# EAGLE design MiniDice (EAGLE 9.2.0)
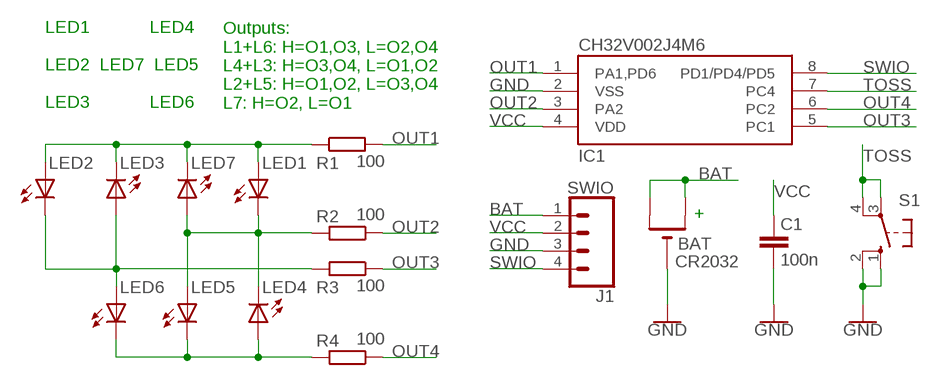
[diagram p0: schematic, sheet 1]

## Parts
BAT  CR2032  CR2032SMT  [CR2032-SMD]
C1  100n  C-EUC1206K  [C1206K]
IC1  CH32V002J4M6  CH32V003J4M6  [SOP8]
J1  SWIO  CONN_04SMD_LONG  [1X04_SMD_LONG]
LED1  LEDLED5MMB  [LED5MMB]
LED2  LEDLED5MMB  [LED5MMB]
LED3  LEDLED5MMB  [LED5MMB]
LED4  LEDLED5MMB  [LED5MMB]
LED5  LEDLED5MMB  [LED5MMB]
LED6  LEDLED5MMB  [LED5MMB]
LED7  LEDLED5MMB  [LED5MMB]
R1  100  R-EU_M1206  [M1206]
R2  100  R-EU_M1206  [M1206]
R3  100  R-EU_M1206  [M1206]
R4  100  R-EU_M1206  [M1206]
S1  10-XXB3F-10XXSMD  [B3F-10XXSMD]

## Nets
BAT: BAT.+$1(+) BAT.+$2(+1) J1.1
GND: BAT.- C1.2 IC1.2(VSS) J1.3 S1.1(S) S1.2(S1)
N$1: LED4.A LED5.K(C) LED6.K(C) R4.2
N$2: LED1.A LED2.A LED3.K(C) LED7.K(C) R1.1
N$3: LED1.K(C) LED4.K(C) LED5.A LED7.A R2.2
N$4: LED2.K(C) LED3.A LED6.A R3.2
OUT1: IC1.1(PA1,PD6) R1.2
OUT2: IC1.3(PA2) R2.1
OUT3: IC1.5(PC1) R3.1
OUT4: IC1.6(PC2) R4.1
SWIO: IC1.8(PD1/PD4/PD5) J1.4
TOSS: IC1.7(PC4) S1.3(P) S1.4(P1)
VCC: C1.1 IC1.4(VDD) J1.2

## Notes on the sheet
- Outputs:
  L1+L6: H=O1,O3, L=O2,O4
  L4+L3: H=O3,O4, L=O1,O2
  L2+L5: H=O1,O2, L=O3,O4
  L7: H=O2, L=O1
- LED1            LED4
  
  LED2  LED7  LED5
  
  LED3            LED6
- +

## Library data of the parts
BAT = adafruit:CR2032
C1 = rcl:C-EU: CAPACITOR, European symbol; SPICEPREFIX: C
IC1 = CH32V:CH32V003J4M6
J1 = SparkFun-Connectors:CONN_04: Multi connection point. Often used as Generic Header-pin footprint for 0.1 inch spaced/style header connections On any of the 0.1 inch spaced packages, you can populate with these: Break Away Headers - Straight <https://www.sparkfun.com/products/116> (PRT-00116) Break Away Male Headers - Right Angle <https://www.sparkfun.com/products/553> (PRT-00553) Female Headers <https://www.sparkfun.com/products/115> (PRT-00115) Break Away Headers - Machine Pin <https://www.sparkfun.com/products/117> (PRT-00117) Break Away Female Headers - Swiss Machine Pin <https://www.sparkfun.com/products/743> (PRT-00743) For SCREWTERMINALS and SPRING TERMINALS visit here: Screw Terimnals on SparkFun.com <https://www.sparkfun.com/search/results?term=Screw+Terminals> (5mm/3.5mm/2.54mm spacing) This device is also useful as a general connection point to wire up your design to another part of your project. Our various solder wires solder well into these plated through hole pads. Hook-Up Wire - Assortment (Stranded, 22 AWG) <https://www.sparkfun.com/products/11375> (PRT-11375) Hook-Up Wire - Assortment (Solid Core, 22 AWG) <https://www.sparkfun.com/products/11367> (PRT-11367) View the entire wire category on our website here <https://www.sparkfun.com/categories/141> Special notes: Molex polarized connector foot print use with SKU : PRT-08231 with associated crimp pins and housings. 1MM SMD Version SKU: PRT-10208; PROD_ID: CONN-09140; SF_ID: PRT-12638
LED1-LED7 = adafruit_B:LED: LED OSRAM: - CHIPLED LG R971, LG N971, LY N971, LG Q971, LY Q971, LO R971, LY R971 LH N974, LH R974 LS Q976, LO Q976, LY Q976 LO Q996 - Hyper CHIPLED LW Q18S LB Q993, LB Q99A, LB R99A - SideLED LS A670, LO A670, LY A670, LG A670, LP A670 LB A673, LV A673, LT A673, LW A673 LH A674 LY A675 LS A676, LA A676, LO A676, LY A676, LW A676 LS A679, LY A679, LG A679 - Hyper Micro SIDELED® LS Y876, LA Y876, LO Y876, LY Y876 LT Y87S - SmartLED LW L88C, LW L88S LB L89C, LB L89S, LG L890 LS L89K, LO L89K, LY L89K LS L896, LA L896, LO L896, LY L896 - TOPLED LS T670, LO T670, LY T670, LG T670, LP T670 LSG T670, LSP T670, LSY T670, LOP T670, LYG T670 LG T671, LOG T671, LSG T671 LB T673, LV T673, LT T673, LW T673 LH T674 LS T676, LA T676, LO T676, LY T676, LB T676, LH T676, LSB T676, LW T676 LB T67C, LV T67C, LT T67C, LS T67K, LO T67K, LY T67K, LW E67C LS E67B, LA E67B, LO E67B, LY E67B, LB E67C, LV E67C, LT E67C LW T67C LS T679, LY T679, LG T679 LS T770, LO T770, LY T770, LG T770, LP T770 LB T773, LV T773, LT T773, LW T773 LH T774 LS E675, LA E675, LY E675, LS T675 LS T776, LA T776, LO T776, LY T776, LB T776 LHGB T686 LT T68C, LB T68C - Hyper Mini TOPLED® LB M676 - Mini TOPLED Santana® LG M470 LS M47K, LO M47K, LY M47K Source: http://www.osram.convergy.de/
R1-R4 = rcl:R-EU_: RESISTOR, European symbol; SPICEPREFIX: R
S1 = switch-omron2:10-XX: OMRON SWITCH

## Board
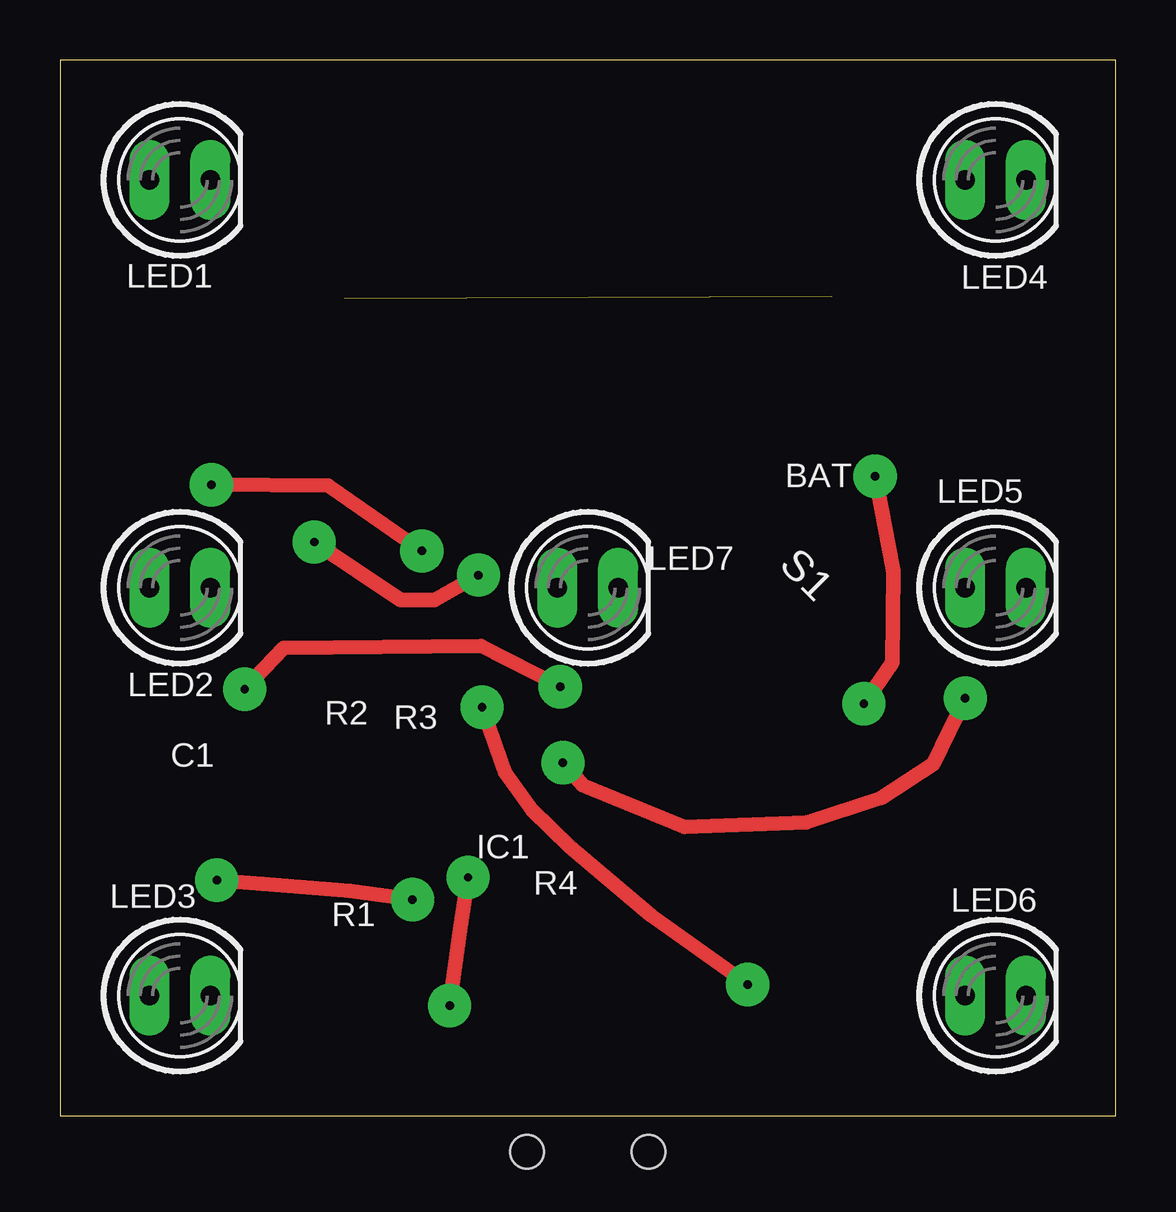
[diagram p1: board, top side]
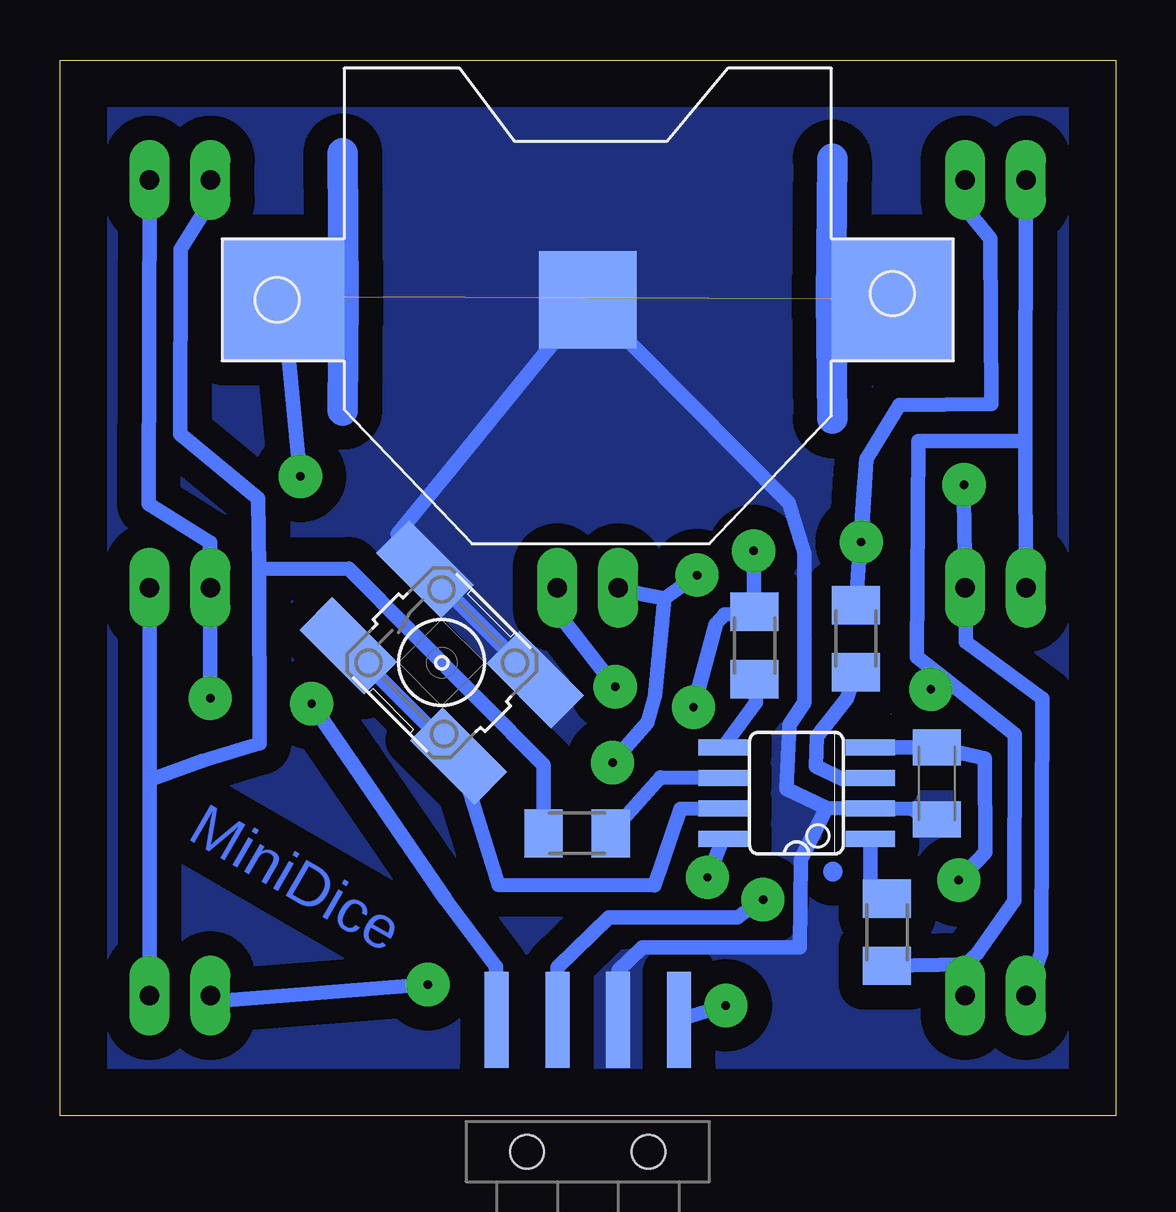
[diagram p2: board, bottom side, seen from below]

Size 44 x 44 mm. Coordinates in mm from the lower left corner, seen from the top.
Outline: 0,0 44,0 44,44 0,44 0,0
Copper layers (1*16): Top 0.035mm / dielectric 1.5mm / Bottom 0.035mm
Design rules "default": minimum track width 6mil, minimum drill 0.35mm, track to track 6mil, track to pad 6mil, pad to pad 6mil, via to via 6mil, smd to smd 6mil, copper to edge 40mil, drill to drill 6mil, minimum pad ring 10mil, minimum via ring 8mil, stop-mask expansion 4mil, vias tented up to drill 0mil, thermal gap 10mil

### Footprints (pad centres in the part's own frame; a part is rotated, then mirrored left to right if it is on the bottom)
CR2032-SMD = smd 5.08 x 5.08: +$1 -12.7,0; +$2 12.7,0 | smd 4.064 x 4.064: - 0,0
C1206K = smd 1.5 x 2: 1 -1.5,0; 2 1.5,0
SOP8 = smd 0.66 x 2.032: 1 -1.905,-3.073; 2 -0.635,-3.073; 3 0.635,-3.073; 4 1.905,-3.073; 5 1.905,3.073; 6 0.635,3.073; 7 -0.635,3.073; 8 -1.905,3.073
1X04_SMD_LONG = smd 1 x 4: 1 -3.81,5.5; 2 -1.27,5.5; 3 1.27,5.5; 4 3.81,5.5 | hole 1.4: -2.54,0; 2.54,0
LED5MMB = drill 0.813 pad 1.676 long: A -1.27,0; K 1.27,0
M1206 = smd 1.6 x 2: 1 -1.4,0; 2 1.4,0
B3F-10XXSMD = smd 3.81 x 1.93: 1 -3.251,2.261; 2 3.251,2.261; 3 -3.251,-2.261; 4 3.251,-2.261

### Placement (x,y rotation side)
BAT  22,34 0 bottom
C1  7.45,13.84 270 bottom
IC1  13.3,13.44 90 bottom
J1  22,-1.5 0 bottom
LED1  5,39 0 top
LED2  5,22 0 top
LED3  5,5 0 top
LED4  39,39 0 top
LED5  39,22 0 top
LED6  39,5 0 top
LED7  22,22 0 top
R1  9.52,7.64 90 bottom
R2  10.82,19.88 90 bottom
R3  15.04,19.59 90 bottom
R4  22.44,11.77 180 bottom
S1  28.08,18.88 315 bottom

### Tracks (layer width: path | path; a pad name or v marks a point on that pad's centre or on a via)
BAT  (via drill 0.35 pad 1.8)  (1 unrouted)
  Top 0.61: v33.98,26.65 34.74,22.68 34.7,18.89 v33.51,17.17
  Bottom 0.61: v33.98,26.65 BAT.+$1 32.19,34.15 | v33.51,17.17 27.93,9.01 25.82,6.2 J1.1 | BAT.+$2 11.86,34.05
  Bottom 1.27: 11.81,39.88 11.86,34.05 11.81,29.05 | 32.21,40.12 32.19,34.15 32.21,29.39
GND
  Bottom 0.61: S1.2 S1.1 29.93,24.23 27.23,27.53 BAT.- 13.62,25.54 12.96,23.44 12.98,17.22 13.58,16.29 13.72,13.61 12.05,12.82 | C1.2 8.52,12.79 IC1.2 12.05,12.82 | 12.05,12.82 13.12,10.67 13.16,7 19.72,7.01 20.72,6.04 J1.3
  pour Bottom (isolate 1.016, no thermals): 2,2 2,42 42,42 42,2
N$1
  Bottom 0.61: LED6.K 40.25,13.99 | 40.25,13.99 LED5.K | LED4.A 37.98,37.72 38.97,36.12 38.99,28.41 35.73,25.72 35.7,22.79 | 35.7,22.79 35.68,15.51 38.08,14.79 40.25,13.99 | 35.7,22.79 31.97,22.8 23.84,14.61 R4.2
N$2  (via drill 0.35 pad 1.8)
  Top 0.61: v20.86,17.88 17.56,19.57 9.32,19.49 v7.7,17.77
  Bottom 0.61: LED2.A 3.75,28.12 | 3.75,28.12 LED1.A | LED3.K 6.23,6.3 | 6.23,6.3 6.23,6.32 5.75,6.77 4.21,8.94 4.19,15.89 7.35,18.39 | 7.35,18.39 8.28,19.11 8.21,28.12 3.75,28.12 | R1.1 6.23,6.3 | LED7.K 23.04,20.71 v20.86,17.88 | v7.7,17.77 7.35,18.39
N$3  (via drill 0.35 pad 1.8)
  Top 0.61: v17.44,22.53 15.61,21.5 14.2,21.5 v10.6,23.91 | v37.73,17.4 36.41,14.66 34.24,13.24 31.11,12.21 26.03,12.03 21.81,13.76 v20.96,14.71
  Bottom 0.61: LED1.K 6.27,37.82 5.22,36.55 5.18,29.65 9.02,29.62 10.39,27.37 | 10.39,27.37 10.48,26.14 R2.2 | LED4.K 40.3,25.48 37.74,23.88 37.79,22.46 LED5.A v37.73,17.4 | LED7.A 19.87,21.75 18.79,21.55 | 18.79,21.55 v17.44,22.53 | v10.6,23.91 10.39,27.37 | v20.96,14.71 19.51,16.39 19.2,17.5 18.79,21.55
N$4  (via drill 0.35 pad 1.8)
  Top 0.61: v28.67,5.46 24.63,8.35 21.27,11.19 19.67,12.75 18.55,14.29 v17.59,17.02 | v6.32,26.29 11.17,26.27 v15.08,23.54
  Bottom 0.61: LED3.A 3.08,6.79 3.05,17.38 6.24,19.75 LED2.K 6.32,25.76 v6.32,26.29 | LED6.A 37.65,4.76 v28.67,5.46 | v17.59,17.02 16.66,20.48 16.31,20.88 R3.2 v15.08,23.54
OUT1
  Bottom 0.61: IC1.1 10.22,9.15 R1.2
OUT2
  Bottom 0.61: IC1.3 11.35,14.02 12.48,14.54 12.44,15.8 11.19,17.38 R2.1
OUT3
  Bottom 0.61: IC1.5 15,17.22 R3.1
OUT4
  Bottom 0.61: IC1.6 18.96,14.09 R4.1
SWIO  (via drill 0.35 pad 1.8)
  Top 0.61: v16.24,4.58 16.7,7.88 v17.01,9.93
  Bottom 0.61: J1.4 v16.24,4.58 | v17.01,9.93 IC1.8
TOSS
  Bottom 0.61: S1.3 S1.4 25.72,9.61 19.21,9.59 18.14,12.79 IC1.7
VCC  (via drill 0.35 pad 1.8)
  Top 0.61: v6.53,9.81 8.46,9.67 12.09,9.37 v14.7,9
  Bottom 0.61: IC1.4 C1.1 5.45,14.89 5.43,10.96 v6.53,9.81 | J1.2 23.27,6.18 21.11,8.27 15.77,8.26 v14.7,9
(copper drawn outside any net)
  shapes: Bottom circle x1

### Text on the board
Bottom: MiniDice
Document: SWIO | GND | VCC | BAT